# Altium schematic sheet Analog_Attenuator.SchDoc
size A4; Organization: TESLA Motors, INC; Address1: 3500 Deer Creek Road; Address2: Palo Alto, CA; Address4: U.S.A.; SheetNumber: 8; SheetTotal: 11
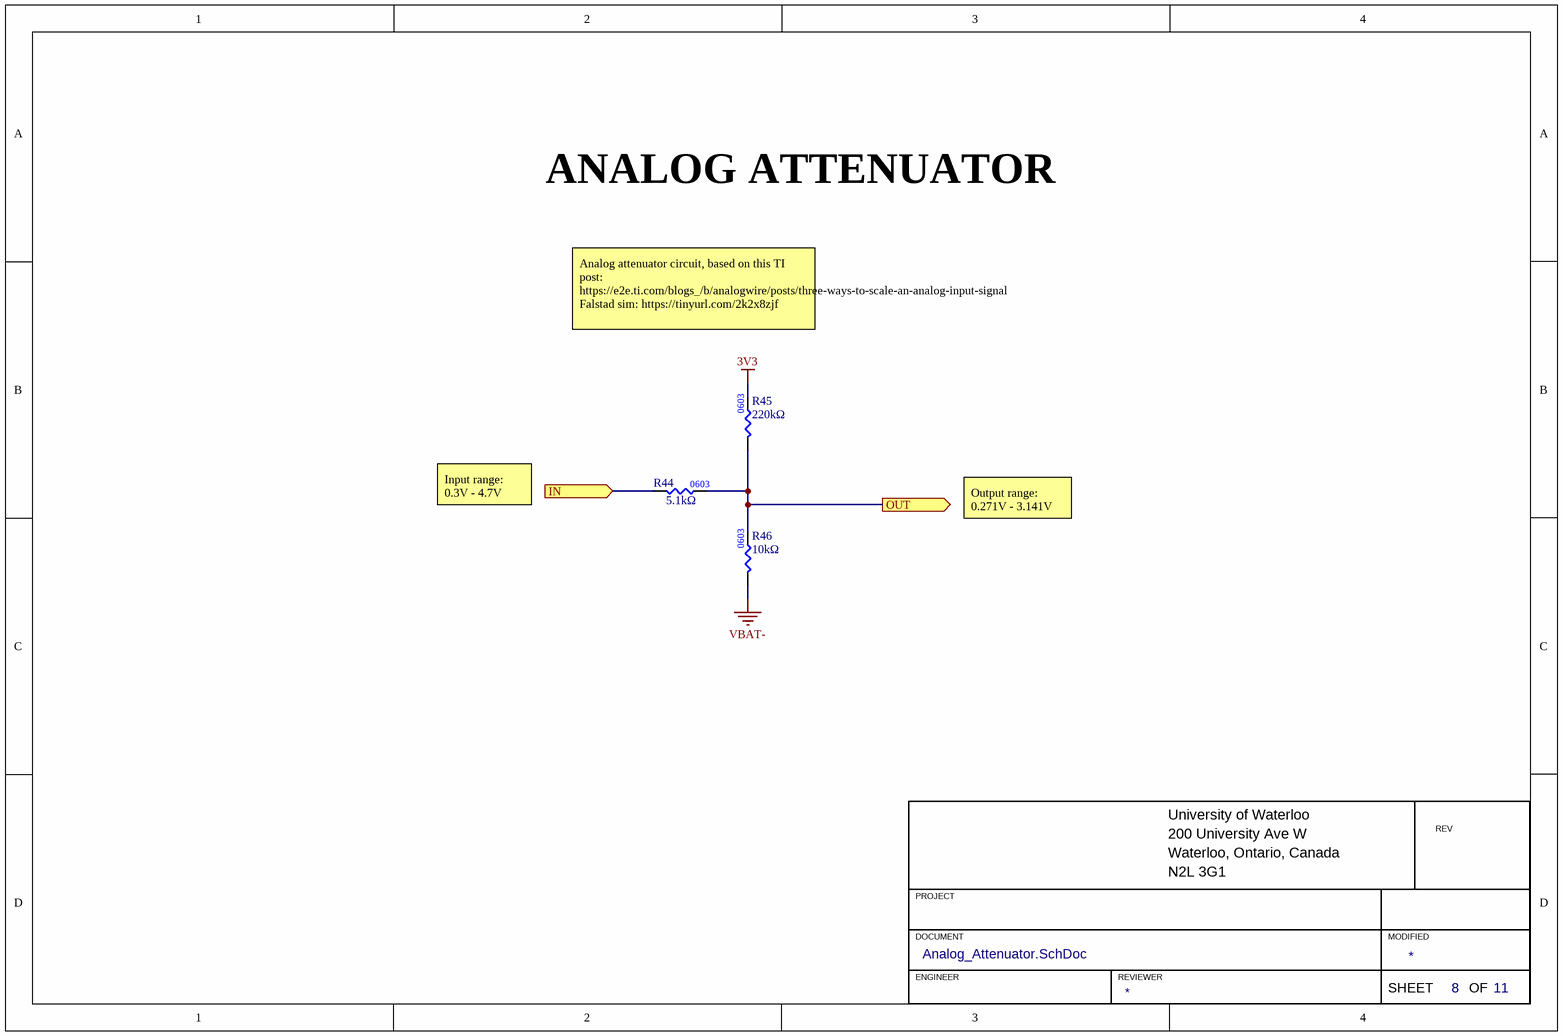
[diagram p0: Analog_Attenuator.SchDoc]

## Parts
R44  value 5.1kΩ  [RES0603]  (hidden comment: RES_5.1kΩ_0603_1%)
R45  value 220kΩ  [RES0603]  (hidden comment: RES_220kΩ_0603_1%)
R46  value 10kΩ  [RES0603]  (hidden comment: RES_10kΩ_0603_1%)

## Ports
IN (in), OUT (out)

## Nets
3V3: R45.2
VBAT-: R46.1
IN: R44.1 ; port IN
OUT: R44.2 R45.1 R46.2 ; port OUT

## Notes on the sheet
- ANALOG ATTENUATOR
- Analog attenuator circuit, based on this TI post: https://e2e.ti.com/blogs_/b/analogwire/posts/three-ways-to-scale-an-analog-input-signal
  Falstad sim: https://tinyurl.com/2k2x8zjf
- Input range: 0.3V - 4.7V
- Output range: 0.271V - 3.141V
- University of Waterloo
- 200 University Ave W
- REV
- PROJECT
- Waterloo, Ontario, Canada
- N2L 3G1
- DOCUMENT
- ENGINEER
- REVIEWER
- MODIFIED
- SHEET
- OF

## Library data of the parts
R44 = RES_5.1kΩ_0603_1%: RES 5.1K OHM 1% 1/10W 0603; Manufacturer 1: YAGEO; Manufacturer Part Number 1: RC0603FR-135K1L; Mounting Type: SMD; Package: 0603; Supplier 1: Digi-Key; Supplier Part Number 1: 13-RC0603FR-135K1LCT-ND
R45 = RES_220kΩ_0603_1%: RES 220K OHM 1% 1/10W 0603; Manufacturer 1: Stackpole Electronics Inc; Manufacturer Part Number 1: RMCF0603FT220K; Supplier 1: Digi-Key; Supplier Part Number 1: RMCF0603FT220KCT-ND; Package: 0603; Tolerance: 1%
R46 = RES_10kΩ_0603_1%: RES 10K OHM 1% 1/8W 0603; Manufacturer 1: Stackpole Electronics Inc; Manufacturer Part Number 1: RNCP0603FTD10K0; Supplier Part Number 1: RNCP0603FTD10K0CT-ND; Supplier 1: Digi-Key; Mounting Type: SMD; Package: 0603